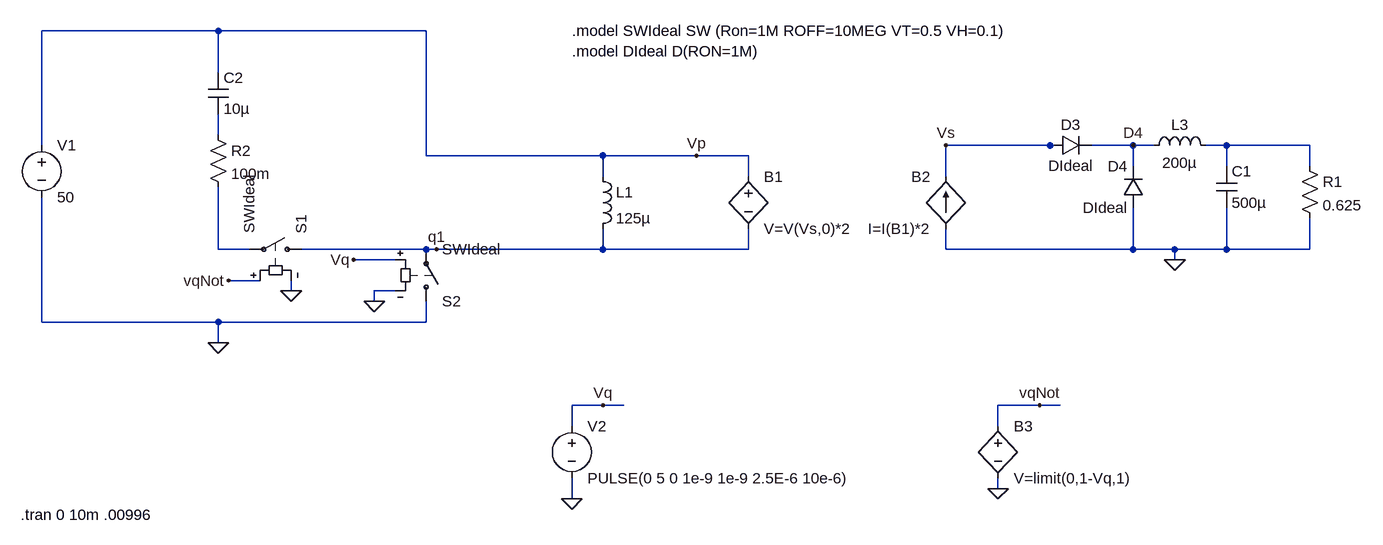
[diagram p0: schematic q3.asc]
q3.asc, the LTspice schematic file:
Version 4
SHEET 1 2024 728
WIRE 256 -32 -16 -32
WIRE 576 -32 256 -32
WIRE 256 32 256 -32
WIRE 256 128 256 96
WIRE -16 144 -16 -32
WIRE 1536 144 1376 144
WIRE 1552 144 1536 144
WIRE 1664 144 1600 144
WIRE 1696 144 1664 144
WIRE 1808 144 1776 144
WIRE 1936 144 1808 144
WIRE 576 160 576 -32
WIRE 848 160 576 160
WIRE 992 160 848 160
WIRE 1072 160 992 160
WIRE 1664 176 1664 144
WIRE 1808 176 1808 144
WIRE 1936 176 1936 144
WIRE 848 192 848 160
WIRE 1072 192 1072 160
WIRE 1376 192 1376 144
WIRE 256 304 256 208
WIRE 304 304 256 304
WIRE 576 304 384 304
WIRE 592 304 576 304
WIRE 848 304 848 272
WIRE 848 304 592 304
WIRE 1072 304 1072 272
WIRE 1072 304 848 304
WIRE 1376 304 1376 272
WIRE 1664 304 1664 240
WIRE 1664 304 1376 304
WIRE 1728 304 1664 304
WIRE 1808 304 1808 240
WIRE 1808 304 1728 304
WIRE 1936 304 1936 256
WIRE 1936 304 1808 304
WIRE 528 320 464 320
WIRE 1728 320 1728 304
WIRE 320 352 272 352
WIRE 368 368 368 352
WIRE 528 368 496 368
WIRE 496 384 496 368
WIRE -16 416 -16 224
WIRE 256 416 -16 416
WIRE 576 416 576 384
WIRE 576 416 256 416
WIRE 256 448 256 416
WIRE 848 544 800 544
WIRE 880 544 848 544
WIRE 1520 544 1456 544
WIRE 1552 544 1520 544
WIRE 800 576 800 544
WIRE 1456 576 1456 544
WIRE 1456 672 1456 656
WIRE 800 688 800 656
FLAG 256 448 0
FLAG 1728 320 0
FLAG 800 688 0
FLAG 848 544 Vq
FLAG 464 320 Vq
FLAG 496 384 0
FLAG 1376 144 Vs
FLAG 992 160 Vp
FLAG 592 304 q1
FLAG 1664 144 D4
FLAG 1456 672 0
FLAG 1520 544 vqNot
FLAG 272 352 vqNot
FLAG 368 368 0
SYMBOL voltage -16 128 R0
WINDOW 123 0 0 Left 0
WINDOW 39 0 0 Left 0
SYMATTR InstName V1
SYMATTR Value 50
SYMBOL sw 576 400 M180
SYMATTR InstName S2
SYMATTR Value SWIdeal
SYMBOL ind 832 176 R0
SYMATTR InstName L1
SYMATTR Value 125µ
SYMBOL bv 1072 176 R0
SYMATTR InstName B1
SYMATTR Value V=V(Vs,0)*2
SYMBOL bi 1376 272 R180
WINDOW 0 24 80 Left 2
WINDOW 3 24 0 Left 2
SYMATTR InstName B2
SYMATTR Value I=I(B1)*2
SYMBOL diode 1536 160 R270
WINDOW 0 32 32 VTop 2
WINDOW 3 0 32 VBottom 2
SYMATTR InstName D3
SYMATTR Value DIdeal
SYMBOL diode 1680 240 R180
WINDOW 0 24 64 Left 2
WINDOW 3 24 0 Left 2
SYMATTR InstName D4
SYMATTR Value DIdeal
SYMBOL cap 1792 176 R0
SYMATTR InstName C1
SYMATTR Value 500µ
SYMBOL res 1920 160 R0
SYMATTR InstName R1
SYMATTR Value 0.625
SYMBOL voltage 800 560 R0
WINDOW 123 0 0 Left 0
WINDOW 39 0 0 Left 0
SYMATTR InstName V2
SYMATTR Value PULSE(0 5 0 1e-9 1e-9 2.5E-6 10e-6)
SYMBOL ind 1680 160 R270
WINDOW 0 32 56 VTop 2
WINDOW 3 5 56 VBottom 2
SYMATTR InstName L3
SYMATTR Value 200µ
SYMBOL sw 400 304 M270
SYMATTR InstName S1
SYMATTR Value SWIdeal
SYMBOL cap 240 32 R0
SYMATTR InstName C2
SYMATTR Value 10µ
SYMBOL res 240 112 R0
SYMATTR InstName R2
SYMATTR Value 100m
SYMBOL bv 1456 560 R0
SYMATTR InstName B3
SYMATTR Value V=limit(0,1-Vq,1)
TEXT 800 -32 Left 2 !.model SWIdeal SW (Ron=1M ROFF=10MEG VT=0.5 VH=0.1)\n.model DIdeal D(RON=1M)
TEXT -48 712 Left 2 !.tran 0 10m .00996

The netlist it stands for:
* q3.asc
V1 Vp 0 50
S2 0 q1 Vq 0 SWIdeal
L1 Vp q1 125µ
B1 Vp q1 V=V(Vs,0)*2
B2 0 Vs I=I(B1)*2
D3 Vs D4 DIdeal
D4 0 D4 DIdeal
C1 N002 0 500µ
R1 N002 0 0.625
V2 Vq 0 PULSE(0 5 0 1e-9 1e-9 2.5E-6 10e-6)
L3 D4 N002 200µ
S1 q1 N003 vqNot 0 SWIdeal
C2 Vp N001 10µ
R2 N001 N003 100m
B3 vqNot 0 V=limit(0,1-Vq,1)
.model D D
.lib standard.dio
.model SWIdeal SW (Ron=1M ROFF=10MEG VT=0.5 VH=0.1)
.model DIdeal D(RON=1M)
.tran 0 10m .00996
.backanno
.end